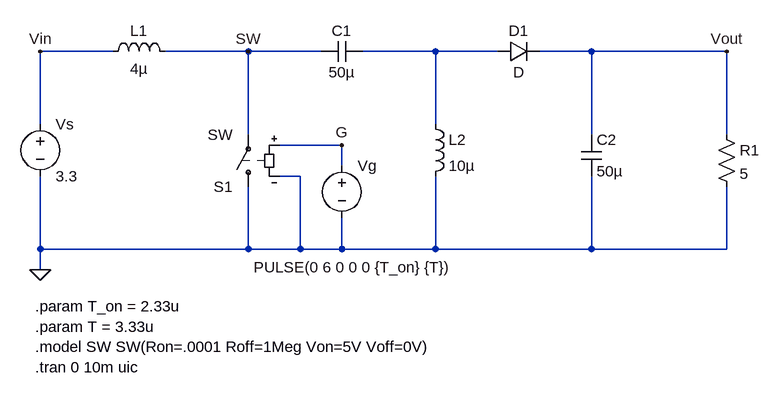
[diagram p0: schematic SEPIC_converter.asc]
SEPIC_converter.asc, the LTspice schematic file:
Version 4
SHEET 1 1144 680
WIRE 96 32 -16 32
WIRE 304 32 176 32
WIRE 416 32 304 32
WIRE 592 32 480 32
WIRE 688 32 592 32
WIRE 832 32 752 32
WIRE 1040 32 832 32
WIRE -16 144 -16 32
WIRE 592 144 592 32
WIRE 304 160 304 32
WIRE 832 160 832 32
WIRE 1040 160 1040 32
WIRE 448 176 352 176
WIRE 448 208 448 176
WIRE 384 224 352 224
WIRE -16 336 -16 224
WIRE 304 336 304 240
WIRE 304 336 -16 336
WIRE 384 336 384 224
WIRE 384 336 304 336
WIRE 448 336 448 288
WIRE 448 336 384 336
WIRE 592 336 592 224
WIRE 592 336 448 336
WIRE 832 336 832 224
WIRE 832 336 592 336
WIRE 1040 336 1040 240
WIRE 1040 336 832 336
WIRE -16 368 -16 336
FLAG -16 368 0
FLAG 1040 32 Vout
FLAG -16 32 Vin
FLAG 304 32 SW
FLAG 448 176 G
SYMBOL voltage -16 128 R0
WINDOW 123 0 0 Left 2
WINDOW 39 0 0 Left 2
SYMATTR InstName Vs
SYMATTR Value 3.3
SYMBOL sw 304 256 R180
SYMATTR InstName S1
SYMBOL diode 688 48 R270
WINDOW 0 32 32 VTop 2
WINDOW 3 0 32 VBottom 2
SYMATTR InstName D1
SYMBOL ind 80 48 R270
WINDOW 0 32 56 VTop 2
WINDOW 3 5 56 VBottom 2
SYMATTR InstName L1
SYMATTR Value 4µ
SYMBOL cap 480 16 R90
WINDOW 0 0 32 VBottom 2
WINDOW 3 32 32 VTop 2
SYMATTR InstName C1
SYMATTR Value 50µ
SYMBOL res 1024 144 R0
SYMATTR InstName R1
SYMATTR Value 5
SYMBOL voltage 448 192 R0
WINDOW 3 -136 172 Left 2
WINDOW 123 0 0 Left 2
WINDOW 39 0 0 Left 2
SYMATTR Value PULSE(0 6 0 0 0 {T_on} {T})
SYMATTR InstName Vg
SYMBOL cap 816 160 R0
SYMATTR InstName C2
SYMATTR Value 50µ
SYMBOL ind 576 128 R0
SYMATTR InstName L2
SYMATTR Value 10µ
TEXT -24 424 Left 2 !.param T_on = 2.33u\n.param T = 3.33u\n.model SW SW(Ron=.0001 Roff=1Meg Von=5V Voff=0V)\n.tran 0 10m uic

The netlist it stands for:
* SEPIC_converter.asc
Vs Vin 0 3.3
S1 0 SW G 0 SW
D1 N001 Vout D
L1 Vin SW 4µ
C1 N001 SW 50µ
R1 Vout 0 5
Vg G 0 PULSE(0 6 0 0 0 {T_on} {T})
C2 Vout 0 50µ
L2 N001 0 10µ
.model D D
.lib standard.dio
.param T_on = 2.33u
.param T = 3.33u
.model SW SW(Ron=.0001 Roff=1Meg Von=5V Voff=0V)
.tran 0 10m uic
.backanno
.end